# Altium project Module_RS485_UART_V1.0.PrjPcb
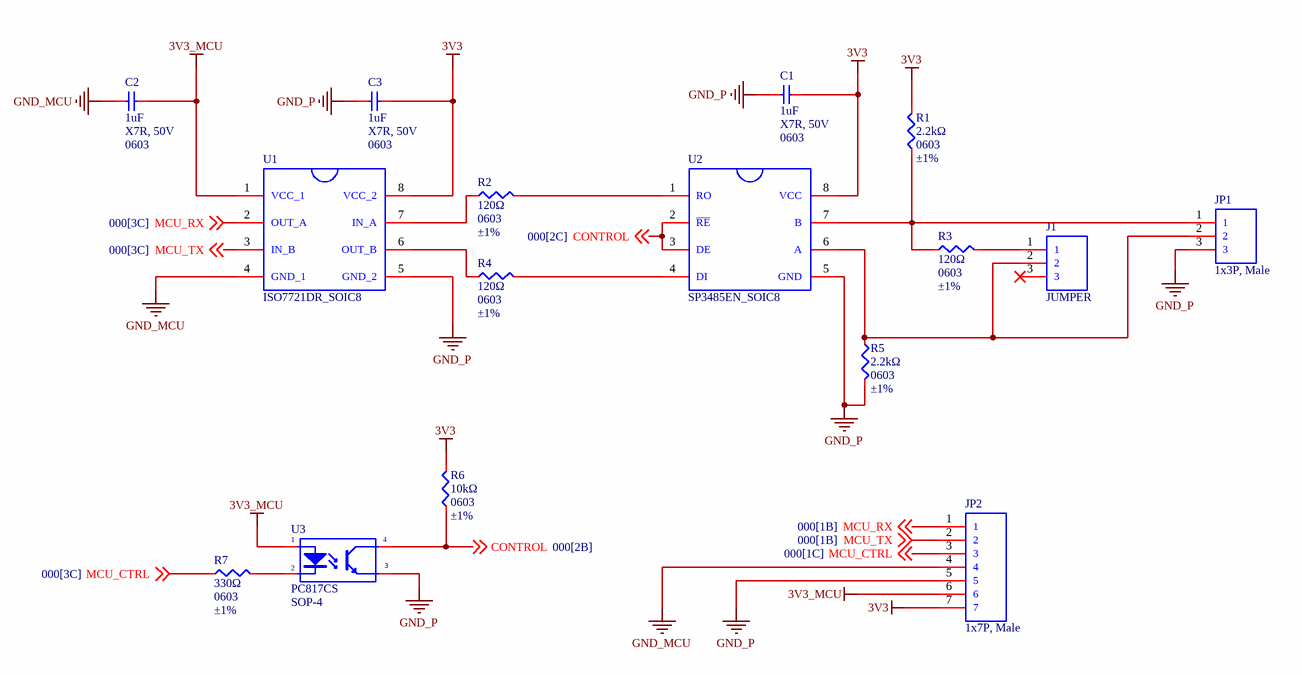
[diagram p0: Schematic.SchDoc]
1 sheet, 16 parts. Net scope: global (net labels, ports and power ports of the same name join across sheets).
Board files: PCB_V1.0.PcbDoc, Panel_V1.0.PcbDoc

## Sheet Schematic.SchDoc: Module_RS485_UART
size A4; Author: Nguyen Quang Minh; Organization: My Company; Address1: Address Line 1; Address2: Address Line 2; Address3: Address Line 3; Address4: Address Line 4; Revision: V1.0; SheetNumber: 000; SheetTotal: 999

### Parts
C1  1uF  Temperature Coefficient: X7R, 50V  Package: 0603  [C0603]
C2  1uF  Temperature Coefficient: X7R, 50V  Package: 0603  [C0603]
C3  1uF  Temperature Coefficient: X7R, 50V  Package: 0603  [C0603]
J1  JUMPER  [JUMPER_SHUNT_3P]
JP1  1x3P, Male  [JST S3B-XH-A(LF)(SN)]
JP2  1x7P, Male  [S7B-XH-A(LF)(SN)]
R1  2.2kΩ  Package: 0603  Tolerance: ±1%  [R0603]
R2  120Ω  Package: 0603  Tolerance: ±1%  [R0603]
R3  120Ω  Package: 0603  Tolerance: ±1%  [R0603]
R4  120Ω  Package: 0603  Tolerance: ±1%  [R0603]
R5  2.2kΩ  Package: 0603  Tolerance: ±1%  [R0603]
R6  10kΩ  Package: 0603  Tolerance: ±1%  [R0603]
R7  330Ω  Package: 0603  Tolerance: ±1%  [R0603]
U1  ISO7721DR_SOIC8  [SOIC-8]
U2  SP3485EN_SOIC8  [SOIC-8]
U3  PC817CS  [SOP-4]

### Nets
3V3: C1.2 C3.2 JP2.7 R1.2 R6.2 U1.8(VCC_2) U2.8(VCC)
3V3_MCU: C2.2 JP2.6 U1.1(VCC_1) U3.1(A)
GND_MCU: C2.1 JP2.4 U1.4(GND_1)
GND_P: C1.1 C3.1 JP1.3 JP2.5 R5.2 U1.5(GND_2) U2.5(GND) U3.3(E)
CONTROL: R6.1 U2.2(~{RE}) U2.3(DE) U3.4(C) ; off-sheet CONTROL
MCU_CTRL: JP2.3 R7.1 ; off-sheet MCU_CTRL
MCU_RX: JP2.1 U1.2(OUT_A) ; off-sheet MCU_RX
MCU_TX: JP2.2 U1.3(IN_B) ; off-sheet MCU_TX
NetJ1_1: J1.1 R3.2
NetJ1_2: J1.2 JP1.2 R5.1 U2.6(A)
NetJP1_1: JP1.1 R1.1 R3.1 U2.7(B)
NetR2_1: R2.1 U1.7(IN_A)
NetR2_2: R2.2 U2.1(RO)
NetR4_1: R4.1 U1.6(OUT_B)
NetR4_2: R4.2 U2.4(DI)
NetR7_2: R7.2 U3.2(K)

Not connected (* = marked no-connect by the designer): J1 3*

### Notes on the sheet
- Author:
- Title:
- Size:
- A4
- Project:
- Approved:
- Revision:
- Modified Date:
- CONFIDENTIAL
- Date:
- SW Version:

### Library data of the parts
C1-C3 = C0603_MLCC_1uF_X7R_50V: 50V 1uF X7R ±10% 0603 Multilayer Ceramic Capacitors MLCC - SMD/SMT ROHS; Manufacturer: YAGEO; Mfr. Part: CC0603KRX7R9BB105; LCSC Part: C559769; Capacitance: 1uF; Link: https://www.lcsc.com/product-detail/C559769.html; Tolerance: ±10%; Voltage Rating: 50V
J1 = JUMPER_SHUNT_3P: 250V 3A Through Hole Pin Header 2.5mm 3P 6mm -40℃~+105℃ 3mm 2.54mm 1 Black 1x3P Through Hole,P=2.54mm Pin Headers ROHS; Manufacturer: XFCN; Mfr. Part: PZ254V-11-03P; LCSC Part: C2937625; Package: Through Hole,P=2.54mm; Insulation Height: Insulation Height; Number of Rows: 1; Link: https://www.lcsc.com/product-detail/C2937625.html; Pin Structure: 1x3P
JP1 = JST S3B-XH-A(LF)(SN): 3P 1x3P XH Tin -25℃~+85℃ White 2.5mm 250V 3 3A 1 Right Angle Through Hole,Right Angle,P=2.5mm Headers, Male Pins ROHS; Manufacturer: JST; Mfr. Part: S3B-XH-A(LF)(SN); LCSC Part: C157928; Package: Through Hole,Right Angle,P=2.5mm; Current Rating-Power: 3A; Link: https://www.lcsc.com/product-detail/C157928.html?s_z=n_S3B-XH-A-E%28LF%29%28SN%29
JP2 = JST S7B-XH-A(LF)(SN): 7P 1x7P XH Tin -25℃~+85℃ White 2.5mm 250V 7 3A 1 Right Angle Through Hole,Right Angle,P=2.5mm Headers, Male Pins ROHS; Manufacturer: JST; Mfr. Part: S7B-XH-A(LF)(SN); LCSC Part: C157916; Package: Through Hole,Right Angle,P=2.5mm; Current Rating-Power: 3A; Link: https://www.lcsc.com/product-detail/C157916.html?s_z=n_S7B-XH-A%28LF%29%28SN%29
R1 R5 = R0603_2.2KΩ_±1%: 100mW 2.2kΩ 75V ±100ppm/℃ Thick Film Resistor ±1% 0603 Chip Resistor - Surface Mount ROHS; Manufacturer: YAGEO; Mfr. Part: RC0603FR-072K2L; LCSC Part: C114662; Resistance: 2.2kΩ; Operating Temperature: -55℃~+155℃; Link: https://www.lcsc.com/product-detail/C114662.html?s_z=n_2.2K%2520ohm
R2-R4 = R0603_120Ω_±1%: 100mW 120Ω 75V ±100ppm/℃ Thick Film Resistor ±1% 0603 Chip Resistor - Surface Mount ROHS; Manufacturer: YAGEO; Mfr. Part: RC0603FR-07120RL; LCSC Part: C114640; Resistance: 120Ω; Operating Temperature: -55℃~+155℃; Link: https://www.lcsc.com/product-detail/C114640.html?s_z=n_120%2520OHM
R6 = R0603_10kΩ_±1%: 100mW Thick Film Resistor 75V ±100ppm/℃ ±1% 10kΩ 0603 Chip Resistor - Surface Mount ROHS; Manufacturer: YAGEO; Mfr. Part: RC0603FR-0710KL; LCSC Part: C98220; Resistance: 10kΩ; Operating Temperature: -55℃~+155℃; Link: https://www.lcsc.com/product-detail/C98220.html
R7 = R0603_330Ω_±1%: 100mW Thick Film Resistor 75V ±100ppm/℃ ±1% 330Ω 0603 Chip Resistor - Surface Mount ROHS; Manufacturer: YAGEO; Mfr. Part: RC0603FR-07330RL; LCSC Part: C105881; Resistance: 330Ω; Operating Temperature: -55℃~+155℃; Link: https://www.lcsc.com/product-detail/C105881.html
U1 = ISO7721DR_SOIC8: 100Mbps SOIC-8 Digital Isolators ROHS; Manufacturer: TI; Voltage - Supply: 2.25V~5.5V; 2.25V~5.5V; Default Output: High Level; Number of Forward Channels: 1; Package: SOIC-8; Mfr. Part: ISO7721DR; LCSC Part: C366164; Link: https://www.lcsc.com/product-detail/C366164.html?s_z=n_ISO7721DR; Data Rate: 100Mbps; Operating Temperature: -55℃~+125℃
U2 = SP3485EN-L/TR_SOIC8: Transceiver 32 Half-Duplex 3.3V SOIC-8 Drivers, Receivers, Transceivers ROHS; Manufacturer: MaxLinear; Package: SOIC-8; Mfr. Part: SP3485EN-L/TR; LCSC Part: C8963; Voltage - Supply: 3.3V; Link: https://www.lcsc.com/product-detail/C8963.html?s_z=n_SP3485; Operating Temperature: -40℃~+85℃
U3 = PC817CS: 50mA 200mV@1mA,20mA 80V 6V 1.2V DC SOP-4 Transistor, Photovoltaic Output Optoisolators ROHS; Manufacturer: AOTE; Key Attributes: OPTOISOLATOR 5kV 1CH TRANS SOP-4; Mfr. Part: PC817CS; LCSC Part: C20612591; Category: Isolators/Optocouplers, Optoisolators/Transistor, Photovoltaic Output Optoisolators; Link: https://www.lcsc.com/product-detail/C20612591.html?s_z=n_pc817; Package: SOP-4